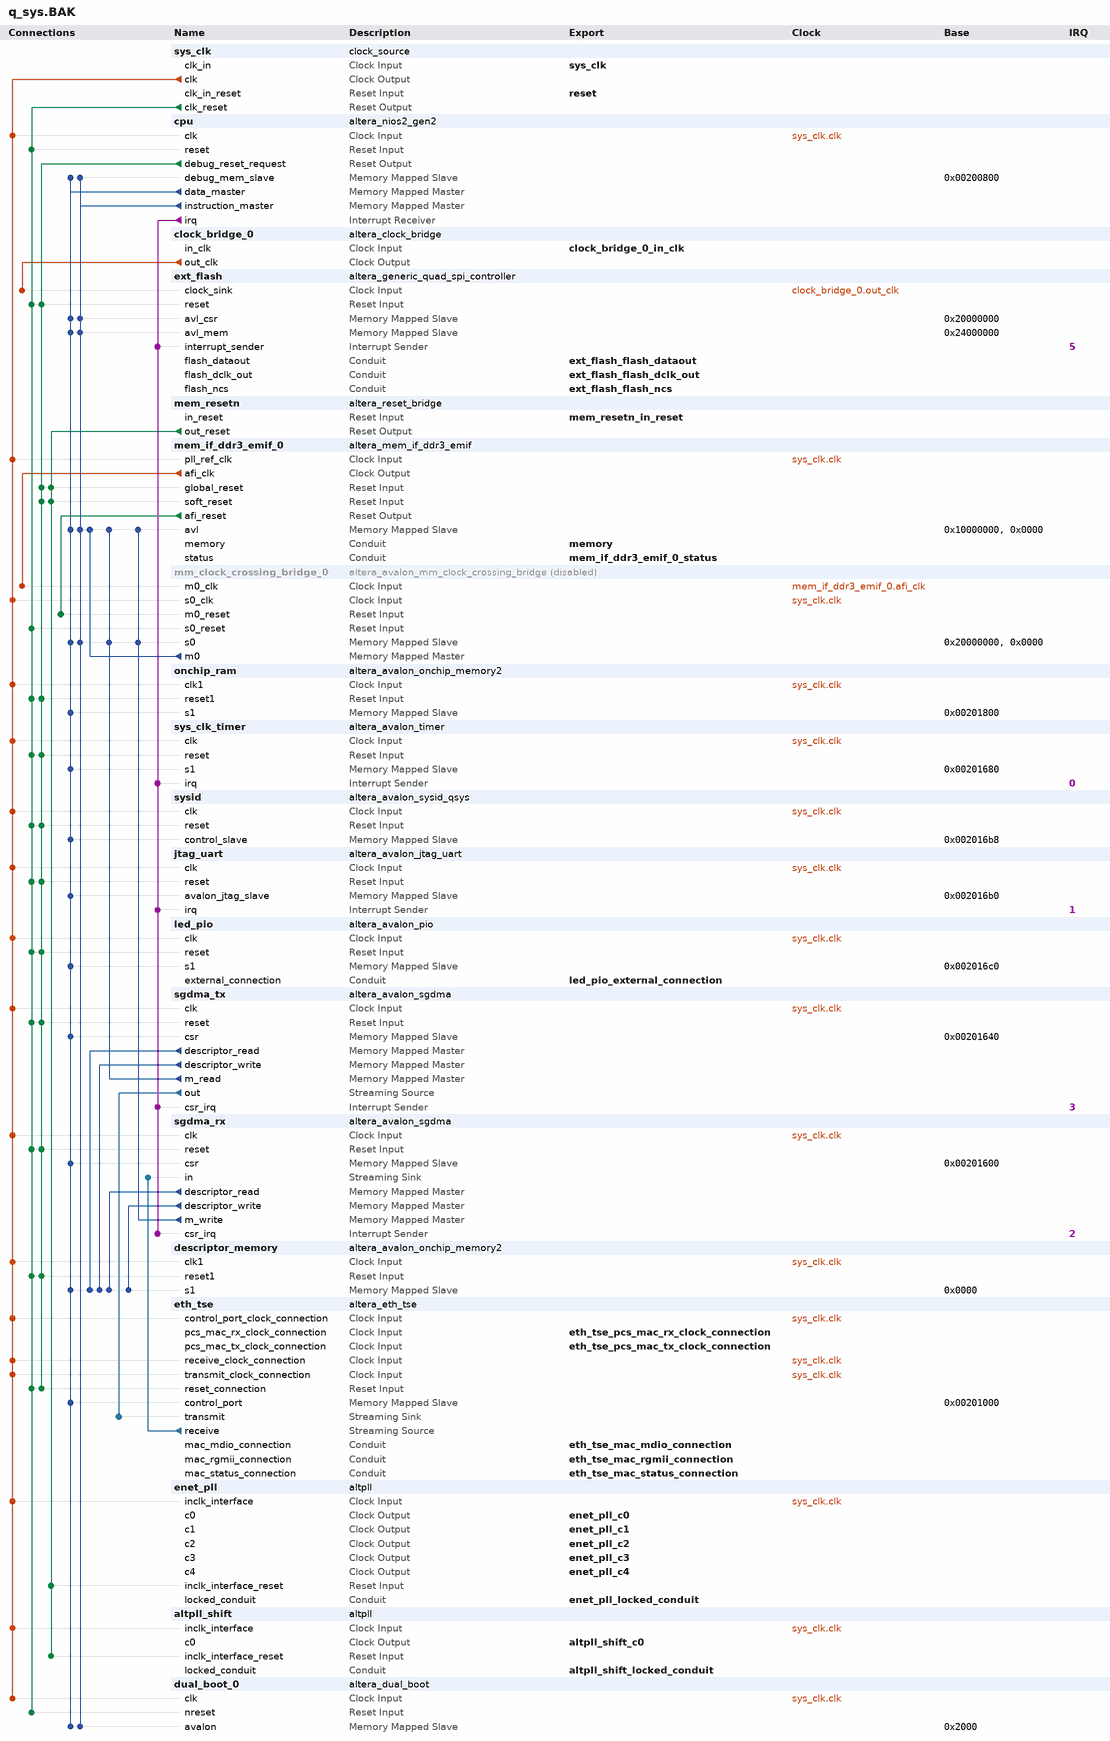
[diagram p0: system contents]
# Platform Designer (Qsys) system q_sys.BAK, MAX 10 10M50DAF484C6GES
# Parameters at their usual value, and those the tool derives, are not listed.
package require -exact qsys 15.0
create_system q_sys.BAK
set_project_property DEVICE_FAMILY {MAX 10}
set_project_property DEVICE 10M50DAF484C6GES

add_instance sys_clk clock_source 15.0
set_instance_parameter_value sys_clk clockFrequency 50000000

add_instance cpu altera_nios2_gen2 15.0
set_instance_parameter_value cpu dcache_size 32768
set_instance_parameter_value cpu exceptionOffset 288
set_instance_parameter_value cpu exceptionSlave mem_if_ddr3_emif_0.avl
set_instance_parameter_value cpu icache_size 32768
set_instance_parameter_value cpu impl Fast
set_instance_parameter_value cpu mul_32_impl 3
set_instance_parameter_value cpu resetOffset 4390912
set_instance_parameter_value cpu resetSlave ext_flash.avl_mem
set_instance_parameter_value cpu setting_activateTrace true
set_instance_parameter_value cpu shift_rot_impl 0

add_instance clock_bridge_0 altera_clock_bridge 15.0
set_instance_parameter_value clock_bridge_0 DERIVED_CLOCK_RATE 0
set_instance_parameter_value clock_bridge_0 EXPLICIT_CLOCK_RATE 0

add_instance ext_flash altera_generic_quad_spi_controller 15.0
set_instance_parameter_value ext_flash CHIP_SELS 1
set_instance_parameter_value ext_flash FLASH_TYPE Micron512
set_instance_parameter_value ext_flash IO_MODE QUAD

add_instance mem_resetn altera_reset_bridge 15.0
set_instance_parameter_value mem_resetn ACTIVE_LOW_RESET 1
set_instance_parameter_value mem_resetn SYNCHRONOUS_EDGES none

add_instance mem_if_ddr3_emif_0 altera_mem_if_ddr3_emif 15.0
set_instance_parameter_value mem_if_ddr3_emif_0 AVL_MAX_SIZE 4
set_instance_parameter_value mem_if_ddr3_emif_0 CALIBRATION_MODE Skip
set_instance_parameter_value mem_if_ddr3_emif_0 CPORT_TYPE_PORT Bidirectional,Bidirectional,Bidirectional,Bidirectional,Bidirectional,Bidirectional
set_instance_parameter_value mem_if_ddr3_emif_0 EXPORT_AFI_HALF_CLK false
set_instance_parameter_value mem_if_ddr3_emif_0 HARD_EMIF false
set_instance_parameter_value mem_if_ddr3_emif_0 MEM_BANKADDR_WIDTH 3
set_instance_parameter_value mem_if_ddr3_emif_0 MEM_CLK_FREQ 300.0
set_instance_parameter_value mem_if_ddr3_emif_0 MEM_CLK_FREQ_MAX 800.0
set_instance_parameter_value mem_if_ddr3_emif_0 MEM_COL_ADDR_WIDTH 10
set_instance_parameter_value mem_if_ddr3_emif_0 MEM_DQ_WIDTH 8
set_instance_parameter_value mem_if_ddr3_emif_0 MEM_DRV_STR RZQ/6
set_instance_parameter_value mem_if_ddr3_emif_0 MEM_FORMAT DISCRETE
set_instance_parameter_value mem_if_ddr3_emif_0 MEM_ROW_ADDR_WIDTH 14
set_instance_parameter_value mem_if_ddr3_emif_0 MEM_RTT_NOM {ODT Disabled}
set_instance_parameter_value mem_if_ddr3_emif_0 MEM_RTT_WR {Dynamic ODT off}
set_instance_parameter_value mem_if_ddr3_emif_0 MEM_TCL 5
set_instance_parameter_value mem_if_ddr3_emif_0 MEM_TFAW_NS 30.0
set_instance_parameter_value mem_if_ddr3_emif_0 MEM_TRAS_NS 35.0
set_instance_parameter_value mem_if_ddr3_emif_0 MEM_TRCD_NS 13.75
set_instance_parameter_value mem_if_ddr3_emif_0 MEM_TRFC_NS 110.0
set_instance_parameter_value mem_if_ddr3_emif_0 MEM_TRP_NS 13.75
set_instance_parameter_value mem_if_ddr3_emif_0 MEM_TRRD_NS 6.0
set_instance_parameter_value mem_if_ddr3_emif_0 MEM_TRTP_NS 7.5
set_instance_parameter_value mem_if_ddr3_emif_0 MEM_TWTR 6
set_instance_parameter_value mem_if_ddr3_emif_0 MEM_VENDOR JEDEC
set_instance_parameter_value mem_if_ddr3_emif_0 MEM_WTCL 5
set_instance_parameter_value mem_if_ddr3_emif_0 PLL_LOCATION Top_Bottom
set_instance_parameter_value mem_if_ddr3_emif_0 POWER_OF_TWO_BUS false
set_instance_parameter_value mem_if_ddr3_emif_0 PRIORITY_PORT 1,1,1,1,1,1
set_instance_parameter_value mem_if_ddr3_emif_0 RATE Half
set_instance_parameter_value mem_if_ddr3_emif_0 REF_CLK_FREQ 50.0
set_instance_parameter_value mem_if_ddr3_emif_0 SPEED_GRADE 6
set_instance_parameter_value mem_if_ddr3_emif_0 TIMING_BOARD_AC_SKEW 0.07801
set_instance_parameter_value mem_if_ddr3_emif_0 TIMING_BOARD_AC_TO_CK_SKEW -0.04709
set_instance_parameter_value mem_if_ddr3_emif_0 TIMING_BOARD_DQ_TO_DQS_SKEW -0.01152
set_instance_parameter_value mem_if_ddr3_emif_0 TIMING_BOARD_MAX_CK_DELAY 0.2443
set_instance_parameter_value mem_if_ddr3_emif_0 TIMING_BOARD_MAX_DQS_DELAY 0.21929
set_instance_parameter_value mem_if_ddr3_emif_0 TIMING_BOARD_SKEW_BETWEEN_DQS 0.04246
set_instance_parameter_value mem_if_ddr3_emif_0 TIMING_BOARD_SKEW_CKDQS_DIMM_MAX 0.04429
set_instance_parameter_value mem_if_ddr3_emif_0 TIMING_BOARD_SKEW_CKDQS_DIMM_MIN 0.02286
set_instance_parameter_value mem_if_ddr3_emif_0 TIMING_BOARD_SKEW_WITHIN_DQS 0.01806
set_instance_parameter_value mem_if_ddr3_emif_0 TIMING_TDH 45
set_instance_parameter_value mem_if_ddr3_emif_0 TIMING_TDQSCK 225
set_instance_parameter_value mem_if_ddr3_emif_0 TIMING_TDQSQ 100
set_instance_parameter_value mem_if_ddr3_emif_0 TIMING_TDQSS 0.27
set_instance_parameter_value mem_if_ddr3_emif_0 TIMING_TDS 10
set_instance_parameter_value mem_if_ddr3_emif_0 TIMING_TDSH 0.18
set_instance_parameter_value mem_if_ddr3_emif_0 TIMING_TDSS 0.18
set_instance_parameter_value mem_if_ddr3_emif_0 TIMING_TIH 120
set_instance_parameter_value mem_if_ddr3_emif_0 TIMING_TIS 170
set_instance_parameter_value mem_if_ddr3_emif_0 TIMING_TQSH 0.4
set_instance_parameter_value mem_if_ddr3_emif_0 USER_DEBUG_LEVEL 1

add_instance mm_clock_crossing_bridge_0 altera_avalon_mm_clock_crossing_bridge 15.0
set_instance_property mm_clock_crossing_bridge_0 ENABLED false
set_instance_parameter_value mm_clock_crossing_bridge_0 ADDRESS_WIDTH 27
set_instance_parameter_value mm_clock_crossing_bridge_0 COMMAND_FIFO_DEPTH 4
set_instance_parameter_value mm_clock_crossing_bridge_0 DATA_WIDTH 32
set_instance_parameter_value mm_clock_crossing_bridge_0 MASTER_SYNC_DEPTH 2
set_instance_parameter_value mm_clock_crossing_bridge_0 MAX_BURST_SIZE 1
set_instance_parameter_value mm_clock_crossing_bridge_0 RESPONSE_FIFO_DEPTH 4
set_instance_parameter_value mm_clock_crossing_bridge_0 SLAVE_SYNC_DEPTH 2
set_instance_parameter_value mm_clock_crossing_bridge_0 USE_AUTO_ADDRESS_WIDTH 0

add_instance onchip_ram altera_avalon_onchip_memory2 15.0
set_instance_parameter_value onchip_ram dataWidth 32
set_instance_parameter_value onchip_ram dualPort false
set_instance_parameter_value onchip_ram initMemContent true
set_instance_parameter_value onchip_ram initializationFileName /data/acastill/simple_socket_10M50/software/niosII_simple_socket_server/mem_init/q_sys_onchip_ram.hex
set_instance_parameter_value onchip_ram memorySize 2048
set_instance_parameter_value onchip_ram useNonDefaultInitFile true

add_instance sys_clk_timer altera_avalon_timer 15.0
set_instance_parameter_value sys_clk_timer period 10
set_instance_parameter_value sys_clk_timer periodUnits MSEC

add_instance sysid altera_avalon_sysid_qsys 15.0
set_instance_parameter_value sysid id -87110914

add_instance jtag_uart altera_avalon_jtag_uart 15.0
set_instance_parameter_value jtag_uart simInteractiveOptions INTERACTIVE_ASCII_OUTPUT

add_instance led_pio altera_avalon_pio 15.0
set_instance_parameter_value led_pio direction Output
set_instance_parameter_value led_pio resetValue 15
set_instance_parameter_value led_pio width 4

add_instance sgdma_tx altera_avalon_sgdma 15.0
set_instance_parameter_value sgdma_tx enableBurstTransfers false
set_instance_parameter_value sgdma_tx enableUnalignedTransfers false
set_instance_parameter_value sgdma_tx readBlockDataWidth 32
set_instance_parameter_value sgdma_tx sinkErrorWidth 0
set_instance_parameter_value sgdma_tx sourceErrorWidth 1
set_instance_parameter_value sgdma_tx transferMode MEMORY_TO_STREAM
set_instance_parameter_value sgdma_tx writeBurstcountWidth 4

add_instance sgdma_rx altera_avalon_sgdma 15.0
set_instance_parameter_value sgdma_rx enableBurstTransfers false
set_instance_parameter_value sgdma_rx enableUnalignedTransfers false
set_instance_parameter_value sgdma_rx readBlockDataWidth 32
set_instance_parameter_value sgdma_rx sinkErrorWidth 6
set_instance_parameter_value sgdma_rx sourceErrorWidth 0
set_instance_parameter_value sgdma_rx transferMode STREAM_TO_MEMORY
set_instance_parameter_value sgdma_rx writeBurstcountWidth 4

add_instance descriptor_memory altera_avalon_onchip_memory2 15.0
set_instance_parameter_value descriptor_memory dataWidth 32
set_instance_parameter_value descriptor_memory dualPort false
set_instance_parameter_value descriptor_memory initMemContent true
set_instance_parameter_value descriptor_memory initializationFileName /data/acastill/simple_socket_10M50/software/niosII_simple_socket_server/mem_init/q_sys_descriptor_memory.hex
set_instance_parameter_value descriptor_memory memorySize 8192
set_instance_parameter_value descriptor_memory useNonDefaultInitFile true

add_instance eth_tse altera_eth_tse 15.0
set_instance_parameter_value eth_tse core_variation MAC_ONLY
set_instance_parameter_value eth_tse enable_hd_logic false
set_instance_parameter_value eth_tse enable_mac_flow_ctrl false
set_instance_parameter_value eth_tse enable_magic_detect true
set_instance_parameter_value eth_tse enable_sgmii true
set_instance_parameter_value eth_tse enable_shift16 true
set_instance_parameter_value eth_tse ifGMII RGMII
set_instance_parameter_value eth_tse ing_addr 11
set_instance_parameter_value eth_tse mdio_clk_div 40
set_instance_parameter_value eth_tse nf_phyip_rcfg_enable true
set_instance_parameter_value eth_tse stat_cnt_ena true
set_instance_parameter_value eth_tse transceiver_type NONE

add_instance enet_pll altpll 15.0
set_instance_parameter_value enet_pll CLK0_DIVIDE_BY 2
set_instance_parameter_value enet_pll CLK0_MULTIPLY_BY 5
set_instance_parameter_value enet_pll CLK1_DIVIDE_BY 2
set_instance_parameter_value enet_pll CLK1_DUTY_CYCLE 50
set_instance_parameter_value enet_pll CLK1_MULTIPLY_BY 1
set_instance_parameter_value enet_pll CLK1_PHASE_SHIFT 0
set_instance_parameter_value enet_pll CLK2_DIVIDE_BY 20
set_instance_parameter_value enet_pll CLK2_DUTY_CYCLE 50
set_instance_parameter_value enet_pll CLK2_MULTIPLY_BY 1
set_instance_parameter_value enet_pll CLK2_PHASE_SHIFT 0
set_instance_parameter_value enet_pll CLK3_DIVIDE_BY 2
set_instance_parameter_value enet_pll CLK3_DUTY_CYCLE 50
set_instance_parameter_value enet_pll CLK3_MULTIPLY_BY 5
set_instance_parameter_value enet_pll CLK3_PHASE_SHIFT -3000
set_instance_parameter_value enet_pll CLK4_DIVIDE_BY 2
set_instance_parameter_value enet_pll CLK4_DUTY_CYCLE 50
set_instance_parameter_value enet_pll CLK4_MULTIPLY_BY 1
set_instance_parameter_value enet_pll CLK4_PHASE_SHIFT -10000
set_instance_parameter_value enet_pll INCLK0_INPUT_FREQUENCY 20000
set_instance_parameter_value enet_pll OPERATION_MODE NO_COMPENSATION
set_instance_parameter_value enet_pll PORT_ARESET PORT_UNUSED
set_instance_parameter_value enet_pll PORT_LOCKED PORT_USED
set_instance_parameter_value enet_pll PORT_clk1 PORT_USED
set_instance_parameter_value enet_pll PORT_clk2 PORT_USED
set_instance_parameter_value enet_pll PORT_clk3 PORT_USED
set_instance_parameter_value enet_pll PORT_clk4 PORT_USED

add_instance altpll_shift altpll 15.0
set_instance_parameter_value altpll_shift CLK0_DIVIDE_BY 1
set_instance_parameter_value altpll_shift CLK0_MULTIPLY_BY 5
set_instance_parameter_value altpll_shift CLK1_DIVIDE_BY 2
set_instance_parameter_value altpll_shift CLK1_DUTY_CYCLE 50
set_instance_parameter_value altpll_shift CLK1_MULTIPLY_BY 1
set_instance_parameter_value altpll_shift CLK1_PHASE_SHIFT 15000
set_instance_parameter_value altpll_shift CLK2_DIVIDE_BY 20
set_instance_parameter_value altpll_shift CLK2_DUTY_CYCLE 50
set_instance_parameter_value altpll_shift CLK2_MULTIPLY_BY 1
set_instance_parameter_value altpll_shift CLK2_PHASE_SHIFT 0
set_instance_parameter_value altpll_shift INCLK0_INPUT_FREQUENCY 20000
set_instance_parameter_value altpll_shift PORT_ARESET PORT_USED
set_instance_parameter_value altpll_shift PORT_LOCKED PORT_USED
set_instance_parameter_value altpll_shift PORT_clk1 PORT_UNUSED
set_instance_parameter_value altpll_shift PORT_clk2 PORT_UNUSED
set_instance_parameter_value altpll_shift PORT_clk3 PORT_UNUSED

add_instance dual_boot_0 altera_dual_boot 15.0
set_instance_parameter_value dual_boot_0 CLOCK_FREQUENCY 50.0

# connections
add_connection clock_bridge_0.out_clk ext_flash.clock_sink clock
add_connection mem_if_ddr3_emif_0.afi_clk mm_clock_crossing_bridge_0.m0_clk clock
add_connection sys_clk.clk altpll_shift.inclk_interface clock
add_connection sys_clk.clk cpu.clk clock
add_connection sys_clk.clk descriptor_memory.clk1 clock
add_connection sys_clk.clk dual_boot_0.clk clock
add_connection sys_clk.clk enet_pll.inclk_interface clock
add_connection sys_clk.clk eth_tse.control_port_clock_connection clock
add_connection sys_clk.clk eth_tse.receive_clock_connection clock
add_connection sys_clk.clk eth_tse.transmit_clock_connection clock
add_connection sys_clk.clk jtag_uart.clk clock
add_connection sys_clk.clk led_pio.clk clock
add_connection sys_clk.clk mem_if_ddr3_emif_0.pll_ref_clk clock
add_connection sys_clk.clk mm_clock_crossing_bridge_0.s0_clk clock
add_connection sys_clk.clk onchip_ram.clk1 clock
add_connection sys_clk.clk sgdma_rx.clk clock
add_connection sys_clk.clk sgdma_tx.clk clock
add_connection sys_clk.clk sys_clk_timer.clk clock
add_connection sys_clk.clk sysid.clk clock
add_connection cpu.debug_reset_request descriptor_memory.reset1 reset
add_connection cpu.debug_reset_request eth_tse.reset_connection reset
add_connection cpu.debug_reset_request ext_flash.reset reset
add_connection cpu.debug_reset_request jtag_uart.reset reset
add_connection cpu.debug_reset_request led_pio.reset reset
add_connection cpu.debug_reset_request mem_if_ddr3_emif_0.global_reset reset
add_connection cpu.debug_reset_request mem_if_ddr3_emif_0.soft_reset reset
add_connection cpu.debug_reset_request onchip_ram.reset1 reset
add_connection cpu.debug_reset_request sgdma_rx.reset reset
add_connection cpu.debug_reset_request sgdma_tx.reset reset
add_connection cpu.debug_reset_request sys_clk_timer.reset reset
add_connection cpu.debug_reset_request sysid.reset reset
add_connection mem_if_ddr3_emif_0.afi_reset mm_clock_crossing_bridge_0.m0_reset reset
add_connection mem_resetn.out_reset altpll_shift.inclk_interface_reset reset
add_connection mem_resetn.out_reset enet_pll.inclk_interface_reset reset
add_connection mem_resetn.out_reset mem_if_ddr3_emif_0.global_reset reset
add_connection mem_resetn.out_reset mem_if_ddr3_emif_0.soft_reset reset
add_connection sys_clk.clk_reset cpu.reset reset
add_connection sys_clk.clk_reset descriptor_memory.reset1 reset
add_connection sys_clk.clk_reset dual_boot_0.nreset reset
add_connection sys_clk.clk_reset eth_tse.reset_connection reset
add_connection sys_clk.clk_reset ext_flash.reset reset
add_connection sys_clk.clk_reset jtag_uart.reset reset
add_connection sys_clk.clk_reset led_pio.reset reset
add_connection sys_clk.clk_reset mm_clock_crossing_bridge_0.s0_reset reset
add_connection sys_clk.clk_reset onchip_ram.reset1 reset
add_connection sys_clk.clk_reset sgdma_rx.reset reset
add_connection sys_clk.clk_reset sgdma_tx.reset reset
add_connection sys_clk.clk_reset sys_clk_timer.reset reset
add_connection sys_clk.clk_reset sysid.reset reset
add_connection cpu.data_master cpu.debug_mem_slave avalon
set_connection_parameter_value cpu.data_master/cpu.debug_mem_slave baseAddress 0x00200800
add_connection cpu.data_master descriptor_memory.s1 avalon
set_connection_parameter_value cpu.data_master/descriptor_memory.s1 baseAddress 0x0000
add_connection cpu.data_master dual_boot_0.avalon avalon
set_connection_parameter_value cpu.data_master/dual_boot_0.avalon baseAddress 0x2000
add_connection cpu.data_master eth_tse.control_port avalon
set_connection_parameter_value cpu.data_master/eth_tse.control_port baseAddress 0x00201000
add_connection cpu.data_master ext_flash.avl_csr avalon
set_connection_parameter_value cpu.data_master/ext_flash.avl_csr baseAddress 0x20000000
add_connection cpu.data_master ext_flash.avl_mem avalon
set_connection_parameter_value cpu.data_master/ext_flash.avl_mem baseAddress 0x24000000
add_connection cpu.data_master jtag_uart.avalon_jtag_slave avalon
set_connection_parameter_value cpu.data_master/jtag_uart.avalon_jtag_slave baseAddress 0x002016b0
add_connection cpu.data_master led_pio.s1 avalon
set_connection_parameter_value cpu.data_master/led_pio.s1 baseAddress 0x002016c0
add_connection cpu.data_master mem_if_ddr3_emif_0.avl avalon
set_connection_parameter_value cpu.data_master/mem_if_ddr3_emif_0.avl baseAddress 0x10000000
add_connection cpu.data_master mm_clock_crossing_bridge_0.s0 avalon
set_connection_parameter_value cpu.data_master/mm_clock_crossing_bridge_0.s0 baseAddress 0x20000000
add_connection cpu.data_master onchip_ram.s1 avalon
set_connection_parameter_value cpu.data_master/onchip_ram.s1 baseAddress 0x00201800
add_connection cpu.data_master sgdma_rx.csr avalon
set_connection_parameter_value cpu.data_master/sgdma_rx.csr baseAddress 0x00201600
add_connection cpu.data_master sgdma_tx.csr avalon
set_connection_parameter_value cpu.data_master/sgdma_tx.csr baseAddress 0x00201640
add_connection cpu.data_master sys_clk_timer.s1 avalon
set_connection_parameter_value cpu.data_master/sys_clk_timer.s1 baseAddress 0x00201680
add_connection cpu.data_master sysid.control_slave avalon
set_connection_parameter_value cpu.data_master/sysid.control_slave baseAddress 0x002016b8
add_connection cpu.instruction_master cpu.debug_mem_slave avalon
set_connection_parameter_value cpu.instruction_master/cpu.debug_mem_slave baseAddress 0x00200800
add_connection cpu.instruction_master dual_boot_0.avalon avalon
set_connection_parameter_value cpu.instruction_master/dual_boot_0.avalon baseAddress 0x2000
add_connection cpu.instruction_master ext_flash.avl_csr avalon
set_connection_parameter_value cpu.instruction_master/ext_flash.avl_csr baseAddress 0x20000000
add_connection cpu.instruction_master ext_flash.avl_mem avalon
set_connection_parameter_value cpu.instruction_master/ext_flash.avl_mem baseAddress 0x24000000
add_connection cpu.instruction_master mem_if_ddr3_emif_0.avl avalon
set_connection_parameter_value cpu.instruction_master/mem_if_ddr3_emif_0.avl baseAddress 0x10000000
add_connection cpu.instruction_master mm_clock_crossing_bridge_0.s0 avalon
set_connection_parameter_value cpu.instruction_master/mm_clock_crossing_bridge_0.s0 baseAddress 0x20000000
add_connection mm_clock_crossing_bridge_0.m0 mem_if_ddr3_emif_0.avl avalon
set_connection_parameter_value mm_clock_crossing_bridge_0.m0/mem_if_ddr3_emif_0.avl baseAddress 0x0000
add_connection sgdma_rx.descriptor_read descriptor_memory.s1 avalon
set_connection_parameter_value sgdma_rx.descriptor_read/descriptor_memory.s1 baseAddress 0x0000
add_connection sgdma_rx.descriptor_write descriptor_memory.s1 avalon
set_connection_parameter_value sgdma_rx.descriptor_write/descriptor_memory.s1 baseAddress 0x0000
add_connection sgdma_rx.m_write mem_if_ddr3_emif_0.avl avalon
set_connection_parameter_value sgdma_rx.m_write/mem_if_ddr3_emif_0.avl baseAddress 0x10000000
add_connection sgdma_rx.m_write mm_clock_crossing_bridge_0.s0 avalon
set_connection_parameter_value sgdma_rx.m_write/mm_clock_crossing_bridge_0.s0 baseAddress 0x0000
add_connection sgdma_tx.descriptor_read descriptor_memory.s1 avalon
set_connection_parameter_value sgdma_tx.descriptor_read/descriptor_memory.s1 baseAddress 0x0000
add_connection sgdma_tx.descriptor_write descriptor_memory.s1 avalon
set_connection_parameter_value sgdma_tx.descriptor_write/descriptor_memory.s1 baseAddress 0x0000
add_connection sgdma_tx.m_read mem_if_ddr3_emif_0.avl avalon
set_connection_parameter_value sgdma_tx.m_read/mem_if_ddr3_emif_0.avl baseAddress 0x10000000
add_connection sgdma_tx.m_read mm_clock_crossing_bridge_0.s0 avalon
set_connection_parameter_value sgdma_tx.m_read/mm_clock_crossing_bridge_0.s0 baseAddress 0x0000
add_connection eth_tse.receive sgdma_rx.in avalon_streaming
add_connection sgdma_tx.out eth_tse.transmit avalon_streaming
add_connection cpu.irq ext_flash.interrupt_sender interrupt
set_connection_parameter_value cpu.irq/ext_flash.interrupt_sender irqNumber 5
add_connection cpu.irq jtag_uart.irq interrupt
set_connection_parameter_value cpu.irq/jtag_uart.irq irqNumber 1
add_connection cpu.irq sgdma_rx.csr_irq interrupt
set_connection_parameter_value cpu.irq/sgdma_rx.csr_irq irqNumber 2
add_connection cpu.irq sgdma_tx.csr_irq interrupt
set_connection_parameter_value cpu.irq/sgdma_tx.csr_irq irqNumber 3
add_connection cpu.irq sys_clk_timer.irq interrupt
set_connection_parameter_value cpu.irq/sys_clk_timer.irq irqNumber 0

# exported interfaces
add_interface altpll_shift_c0 clock source
set_interface_property altpll_shift_c0 EXPORT_OF altpll_shift.c0
add_interface altpll_shift_locked_conduit conduit end
set_interface_property altpll_shift_locked_conduit EXPORT_OF altpll_shift.locked_conduit
add_interface clock_bridge_0_in_clk clock sink
set_interface_property clock_bridge_0_in_clk EXPORT_OF clock_bridge_0.in_clk
add_interface enet_pll_c0 clock source
set_interface_property enet_pll_c0 EXPORT_OF enet_pll.c0
add_interface enet_pll_c1 clock source
set_interface_property enet_pll_c1 EXPORT_OF enet_pll.c1
add_interface enet_pll_c2 clock source
set_interface_property enet_pll_c2 EXPORT_OF enet_pll.c2
add_interface enet_pll_c3 clock source
set_interface_property enet_pll_c3 EXPORT_OF enet_pll.c3
add_interface enet_pll_c4 clock source
set_interface_property enet_pll_c4 EXPORT_OF enet_pll.c4
add_interface enet_pll_locked_conduit conduit end
set_interface_property enet_pll_locked_conduit EXPORT_OF enet_pll.locked_conduit
add_interface eth_tse_mac_mdio_connection conduit end
set_interface_property eth_tse_mac_mdio_connection EXPORT_OF eth_tse.mac_mdio_connection
add_interface eth_tse_mac_rgmii_connection conduit end
set_interface_property eth_tse_mac_rgmii_connection EXPORT_OF eth_tse.mac_rgmii_connection
add_interface eth_tse_mac_status_connection conduit end
set_interface_property eth_tse_mac_status_connection EXPORT_OF eth_tse.mac_status_connection
add_interface eth_tse_pcs_mac_rx_clock_connection clock sink
set_interface_property eth_tse_pcs_mac_rx_clock_connection EXPORT_OF eth_tse.pcs_mac_rx_clock_connection
add_interface eth_tse_pcs_mac_tx_clock_connection clock sink
set_interface_property eth_tse_pcs_mac_tx_clock_connection EXPORT_OF eth_tse.pcs_mac_tx_clock_connection
add_interface ext_flash_flash_dataout conduit end
set_interface_property ext_flash_flash_dataout EXPORT_OF ext_flash.flash_dataout
add_interface ext_flash_flash_dclk_out conduit end
set_interface_property ext_flash_flash_dclk_out EXPORT_OF ext_flash.flash_dclk_out
add_interface ext_flash_flash_ncs conduit end
set_interface_property ext_flash_flash_ncs EXPORT_OF ext_flash.flash_ncs
add_interface led_pio_external_connection conduit end
set_interface_property led_pio_external_connection EXPORT_OF led_pio.external_connection
add_interface mem_if_ddr3_emif_0_status conduit end
set_interface_property mem_if_ddr3_emif_0_status EXPORT_OF mem_if_ddr3_emif_0.status
add_interface mem_resetn_in_reset reset sink
set_interface_property mem_resetn_in_reset EXPORT_OF mem_resetn.in_reset
add_interface memory conduit end
set_interface_property memory EXPORT_OF mem_if_ddr3_emif_0.memory
add_interface reset reset sink
set_interface_property reset EXPORT_OF sys_clk.clk_in_reset
add_interface sys_clk clock sink
set_interface_property sys_clk EXPORT_OF sys_clk.clk_in

set_interconnect_requirement {$system} qsys_mm.clockCrossingAdapter HANDSHAKE
set_interconnect_requirement {$system} qsys_mm.maxAdditionalLatency 0

save_system q_sys.BAK.qsys
